# EAGLE schematic SB_PCB_MEDAL (EAGLE 8.6.0)
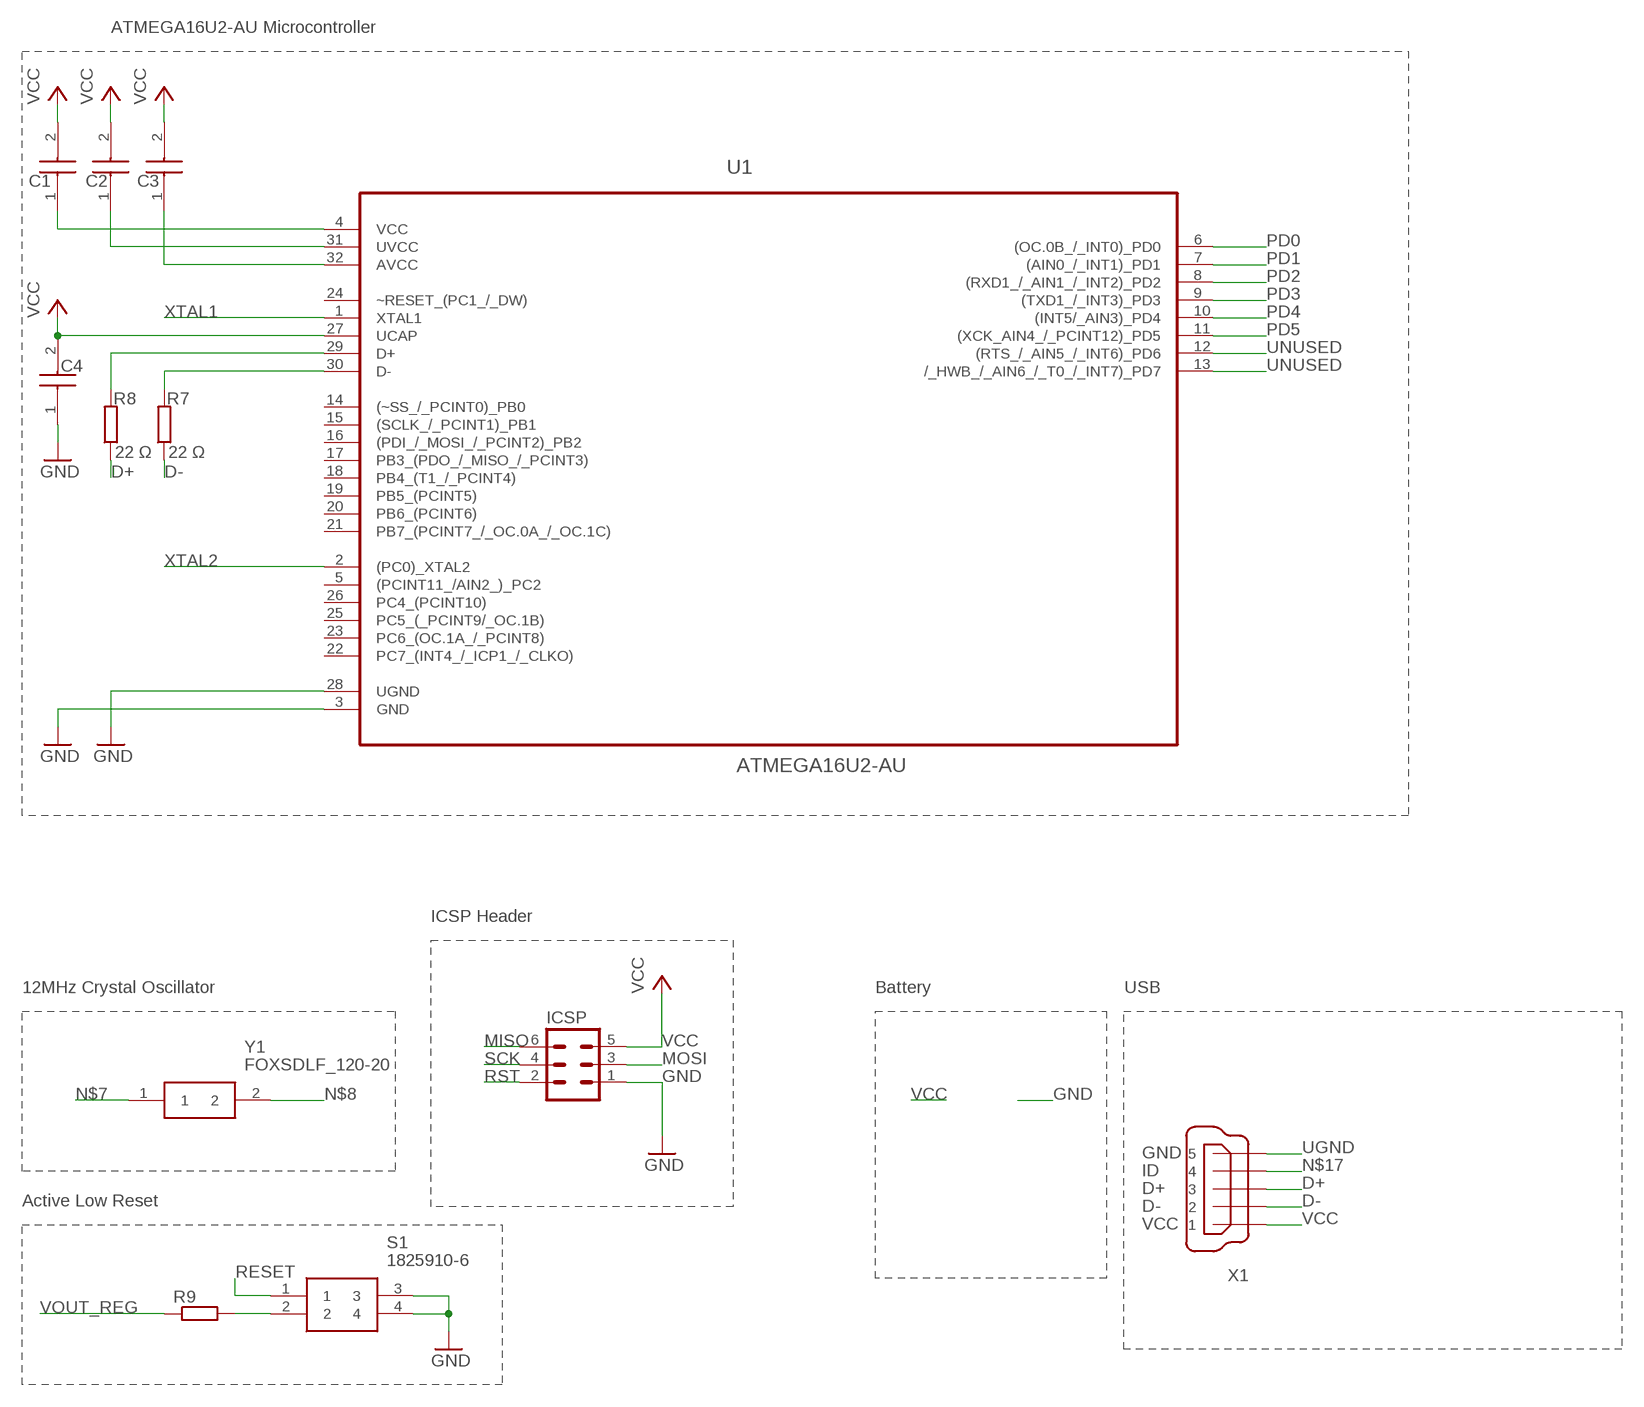
[diagram p0: schematic, sheet 1, part 1 of 2]
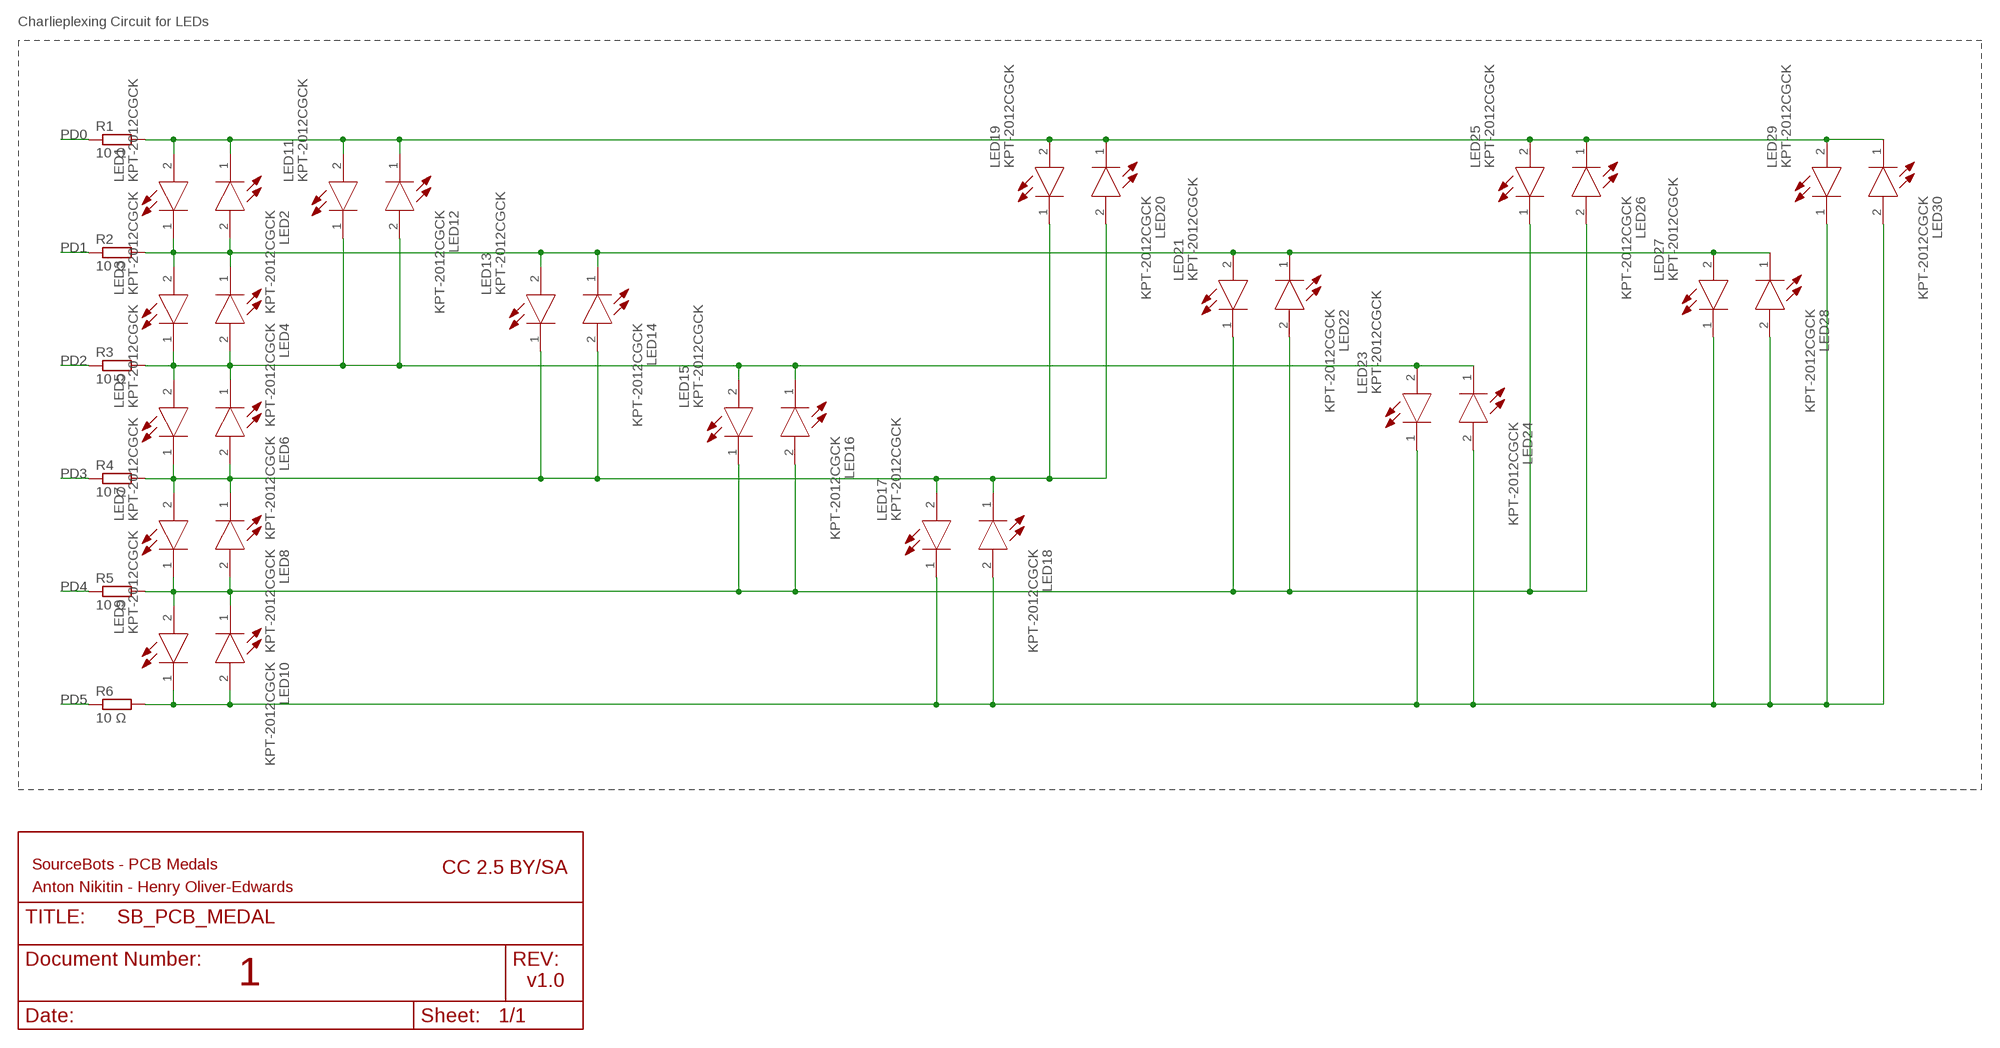
[diagram p1: schematic, sheet 1, part 2 of 2]

## Parts
C1  MC0805B104K250CT  [CAPC2012X60N]
C2  MC0805B104K250CT  [CAPC2012X60N]
C3  MC0805B104K250CT  [CAPC2012X60N]
C4  MC0805B104K250CT  [CAPC2012X60N]
ICSP  MA03-2  [MA03-2]
LED1  KPT-2012CGCK  [LEDC2012X78N]
LED2  KPT-2012CGCK  [LEDC2012X78N]
LED3  KPT-2012CGCK  [LEDC2012X78N]
LED4  KPT-2012CGCK  [LEDC2012X78N]
LED5  KPT-2012CGCK  [LEDC2012X78N]
LED6  KPT-2012CGCK  [LEDC2012X78N]
LED7  KPT-2012CGCK  [LEDC2012X78N]
LED8  KPT-2012CGCK  [LEDC2012X78N]
LED9  KPT-2012CGCK  [LEDC2012X78N]
LED10  KPT-2012CGCK  [LEDC2012X78N]
LED11  KPT-2012CGCK  [LEDC2012X78N]
LED12  KPT-2012CGCK  [LEDC2012X78N]
LED13  KPT-2012CGCK  [LEDC2012X78N]
LED14  KPT-2012CGCK  [LEDC2012X78N]
LED15  KPT-2012CGCK  [LEDC2012X78N]
LED16  KPT-2012CGCK  [LEDC2012X78N]
LED17  KPT-2012CGCK  [LEDC2012X78N]
LED18  KPT-2012CGCK  [LEDC2012X78N]
LED19  KPT-2012CGCK  [LEDC2012X78N]
LED20  KPT-2012CGCK  [LEDC2012X78N]
LED21  KPT-2012CGCK  [LEDC2012X78N]
LED22  KPT-2012CGCK  [LEDC2012X78N]
LED23  KPT-2012CGCK  [LEDC2012X78N]
LED24  KPT-2012CGCK  [LEDC2012X78N]
LED25  KPT-2012CGCK  [LEDC2012X78N]
LED26  KPT-2012CGCK  [LEDC2012X78N]
LED27  KPT-2012CGCK  [LEDC2012X78N]
LED28  KPT-2012CGCK  [LEDC2012X78N]
LED29  KPT-2012CGCK  [LEDC2012X78N]
LED30  KPT-2012CGCK  [LEDC2012X78N]
R1  10 Ω  R-EU_M0805  [M0805]
R2  10 Ω  R-EU_M0805  [M0805]
R3  10 Ω  R-EU_M0805  [M0805]
R4  10 Ω  R-EU_M0805  [M0805]
R5  10 Ω  R-EU_M0805  [M0805]
R6  10 Ω  R-EU_M0805  [M0805]
R7  22 Ω  R-EU_M0805  [M0805]
R8  22 Ω  R-EU_M0805  [M0805]
R9  R-EU_0204/7  [0204/7]
S1  1825910-6  [1825910-6]
U1  ATMEGA16U2-AU  [QFP80P900X900X120-32N]
X1  MINI-USB_SHIELD5P2-32005-601  [32005-601]
Y1  FOXSDLF_120-20  [FOXSDLF/120-20]

## Nets
D+: R8.1 X1.3
D-: R7.1 X1.2
GND: C4.1 ICSP.1 S1.3 S1.4 U1.3(GND)
MISO: ICSP.6
MOSI: ICSP.3
N$1: LED1.2(A) LED2.1(K) LED11.2(A) LED12.1(K) LED19.2(A) LED20.1(K) LED25.2(A) LED26.1(K) LED29.2(A) LED30.1(K) R1.2
N$2: LED1.1(K) LED2.2(A) LED3.2(A) LED4.1(K) LED13.2(A) LED14.1(K) LED21.2(A) LED22.1(K) LED27.2(A) LED28.1(K) R2.2
N$3: LED3.1(K) LED4.2(A) LED5.2(A) LED6.1(K) LED11.1(K) LED12.2(A) LED15.2(A) LED16.1(K) LED23.2(A) LED24.1(K) R3.2
N$4: LED5.1(K) LED6.2(A) LED7.2(A) LED8.1(K) LED13.1(K) LED14.2(A) LED17.2(A) LED18.1(K) LED19.1(K) LED20.2(A) R4.2
N$5: LED7.1(K) LED8.2(A) LED9.2(A) LED10.1(K) LED15.1(K) LED16.2(A) LED21.1(K) LED22.2(A) LED25.1(K) LED26.2(A) R5.2
N$6: LED9.1(K) LED10.2(A) LED17.1(K) LED18.2(A) LED23.1(K) LED24.2(A) LED27.1(K) LED28.2(A) LED29.1(K) LED30.2(A) R6.2
N$7: Y1.1
N$8: Y1.2
N$9: C1.1 U1.4(VCC)
N$10: R9.2 S1.2
N$11: C3.1 U1.32(AVCC)
N$14: R8.2 U1.29(D+)
N$15: R7.2 U1.30(D-)
N$17: X1.4
N$20: U1.12((RTS_/_AIN5_/_INT6)_PD6)
N$21: U1.13(/_HWB_/_AIN6_/_T0_/_INT7)_PD7)
PD0: R1.1 U1.6((OC.0B_/_INT0)_PD0)
PD1: R2.1 U1.7((AIN0_/_INT1)_PD1)
PD2: R3.1 U1.8((RXD1_/_AIN1_/_INT2)_PD2)
PD3: R4.1 U1.9((TXD1_/_INT3)_PD3)
PD4: R5.1 U1.10((INT5/_AIN3)_PD4)
PD5: R6.1 U1.11((XCK_AIN4_/_PCINT12)_PD5)
RESET: S1.1
RST: ICSP.2
UGND: U1.28(UGND) X1.5 ; supply symbol labelled GND
USCK: ICSP.4
UVCC: C2.1 U1.31(UVCC)
VCC: C1.2 C2.2 C3.2 C4.2 ICSP.5 U1.27(UCAP) X1.1
VOUT_REG: R9.1
XTAL1: U1.1(XTAL1)
XTAL2: U1.2((PC0)_XTAL2)
Unconnected: U1.5((PCINT11_/AIN2_)_PC2) U1.14((~SS_/_PCINT0)_PB0) U1.15((SCLK_/_PCINT1)_PB1) U1.16((PDI_/_MOSI_/_PCINT2)_PB2) U1.17(PB3_(PDO_/_MISO_/_PCINT3)) U1.18(PB4_(T1_/_PCINT4)) U1.19(PB5_(PCINT5)) U1.20(PB6_(PCINT6)) U1.21(PB7_(PCINT7_/_OC.0A_/_OC.1C)) U1.22(PC7_(INT4_/_ICP1_/_CLKO)) U1.23(PC6_(OC.1A_/_PCINT8)) U1.24(~RESET_(PC1_/_DW)) U1.25(PC5_(_PCINT9/_OC.1B)) U1.26(PC4_(PCINT10)) X1.M1(S1) X1.M2(S2)

## Notes on the sheet
- ATMEGA16U2-AU Microcontroller
- Charlieplexing Circuit for LEDs
- UNUSED
- UNUSED
- ICSP Header
- 12MHz Crystal Oscillator | Battery | USB
- MISO | VCC
- SCK | MOSI
- RST | GND
- VCC | GND
- GND
- ID
- SourceBots - PCB Medals | CC 2.5 BY/SA
- D+
- Active Low Reset
- D- | Anton Nikitin - Henry Oliver-Edwards
- VCC
- 1 | v1.0

## Library data of the parts
C1-C4 = SamacSys_Parts:MC0805B104K250CT: MULTICOMP - MC0805B104K250CT - CAP, MLCC, X7R, 100NF, 25V, 0805 Source: Datasheet <https://componentsearchengine.com/Datasheets/2/MC0805B104K250CT.pdf>; DESCRIPTION: MULTICOMP - MC0805B104K250CT - CAP, MLCC, X7R, 100NF, 25V, 0805; HEIGHT: 0.6mm; MANUFACTURER_NAME: MULTICOMP; MANUFACTURER_PART_NUMBER: MC0805B104K250CT
ICSP = con-lstb:MA03-2: PIN HEADER; OC_FARNELL: unknown; OC_NEWARK: unknown
LED1-LED30 = SamacSys_Parts:KPT-2012CGCK: Green Chip LED 2x1.25mm Kingbright KPT-2012CGCK Green LED, 570 nm, 2012 (0805), Rectangle Lens SMD Package <https://componentsearchengine.com/Images/3/KPT-2012CGCK.jpg> Source: Datasheet <http://uk.rs-online.com/web/p/products/8610172>; DESCRIPTION: Green Chip LED 2x1.25mm Kingbright KPT-2012CGCK Green LED, 570 nm, 2012 (0805), Rectangle Lens SMD Package; HEIGHT: 0.78mm; MANUFACTURER_NAME: Kingbright; MANUFACTURER_PART_NUMBER: KPT-2012CGCK; RS_PART_NUMBER: 8610172P; SUPPLIER_NAME: RS
R1-R8 = resistor:R-EU_: RESISTOR, European symbol
R9 = rcl:R-EU_: RESISTOR, European symbol; SPICEPREFIX: R
S1 = SamacSys_Parts:1825910-6: TE CONNECTIVITY / ALCOSWITCH - 1825910-6 - TACT SWITCH, SPST, 0.05A, 24VDC, SOLDER Source: Datasheet <http://www.farnell.com/datasheets/921681.pdf>; DESCRIPTION: TE CONNECTIVITY / ALCOSWITCH - 1825910-6 - TACT SWITCH, SPST, 0.05A, 24VDC, SOLDER; HEIGHT: mm; MANUFACTURER_NAME: TE Connectivity; MANUFACTURER_PART_NUMBER: 1825910-6; RS_PART_NUMBER: 1613779; SUPPLIER_NAME: RS
U1 = Atmel_By_element14_Batch_1-00:ATMEGA16U2-AU: 8-bit Microcontroller; MPN: ATMEGA16U2-AU; OC_FARNELL: 1841607; OC_NEWARK: 12T1292; PACKAGE: QFP-32; SUPPLIER: Atmel
X1 = con-cypressindustries:MINI-USB_SHIELD5P2-: MINI USB-B R/A DIP 5pol. Source: www.cypressindustries.com; OC_FARNELL: unknown; OC_NEWARK: unknown
Y1 = SamacSys_Parts:FOXSDLF_120-20: Crystal SMD 12.000MHz HC49S-SMD Crystal 12MHz, 30ppm, 2-Pin SMD, 11.7 x 5 x 4.5mm Source: Datasheet <http://uk.rs-online.com/webdocs/14f6/0900766b814f6551.pdf>; DESCRIPTION: Crystal SMD 12.000MHz HC49S-SMD Crystal 12MHz, 30ppm, 2-Pin SMD, 11.7 x 5 x 4.5mm; HEIGHT: mm; MANUFACTURER_NAME: Fox; MANUFACTURER_PART_NUMBER: FOXSDLF/120-20; RS_PART_NUMBER: 5476480; RS_PRICE/STOCK: http://uk.rs-online.com/web/p/products/5476480